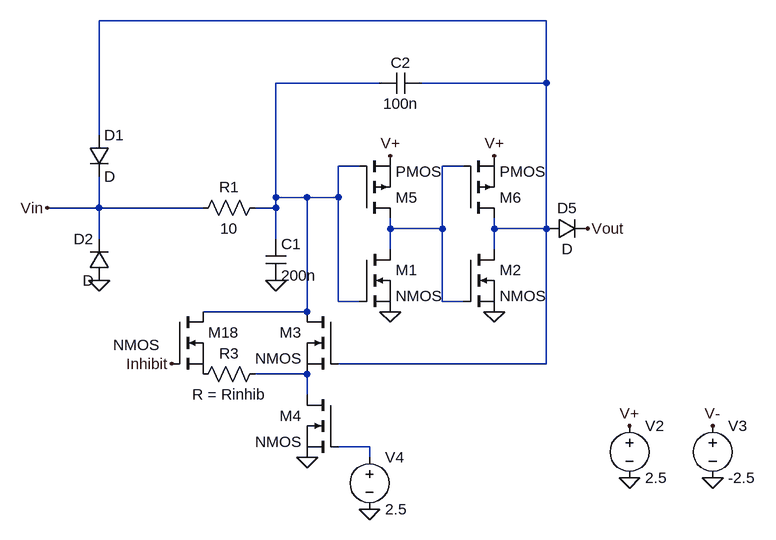
[diagram p0: schematic Axon-Hillock Post.asc]
Axon-Hillock Post.asc, the LTspice schematic file:
Version 4
SHEET 1 964 680
WIRE 640 -240 -48 -240
WIRE 384 -144 224 -144
WIRE 640 -144 640 -240
WIRE 640 -144 448 -144
WIRE -48 -64 -48 -240
WIRE 352 -16 320 -16
WIRE 512 -16 480 -16
WIRE 224 32 224 -144
WIRE 272 32 224 32
WIRE 320 32 320 -16
WIRE 320 32 272 32
WIRE -48 48 -48 0
WIRE -48 48 -128 48
WIRE 112 48 -48 48
WIRE 224 48 224 32
WIRE 224 48 192 48
WIRE 400 80 400 64
WIRE 480 80 480 -16
WIRE 480 80 400 80
WIRE 560 80 560 64
WIRE 640 80 640 -144
WIRE 640 80 560 80
WIRE -48 96 -48 48
WIRE 224 96 224 48
WIRE 400 112 400 80
WIRE 560 112 560 80
WIRE 320 192 320 32
WIRE 352 192 320 192
WIRE 480 192 480 80
WIRE 512 192 480 192
WIRE 272 208 272 32
WIRE 272 208 112 208
WIRE 640 288 640 80
WIRE 640 288 320 288
WIRE 272 304 192 304
WIRE 272 336 272 304
WIRE 368 416 320 416
WIRE 368 432 368 416
FLAG 368 512 0
FLAG 768 464 0
FLAG 896 464 0
FLAG 768 384 V+
FLAG 896 384 V-
FLAG 224 160 0
FLAG 400 -32 V+
FLAG 560 -32 V+
FLAG 560 208 0
FLAG 400 208 0
FLAG 272 432 0
FLAG 64 288 Inhibit
FLAG -128 48 Vin
FLAG 704 80 Vout
FLAG -48 160 0
SYMBOL res 208 32 R90
WINDOW 0 0 56 VBottom 2
WINDOW 3 32 56 VTop 2
SYMATTR InstName R1
SYMATTR Value 10
SYMBOL cap 208 96 R0
SYMATTR InstName C1
SYMATTR Value 200n
SYMBOL cap 448 -160 R90
WINDOW 0 0 32 VBottom 2
WINDOW 3 32 32 VTop 2
SYMATTR InstName C2
SYMATTR Value 100n
SYMBOL voltage 768 368 R0
WINDOW 123 0 0 Left 2
WINDOW 39 0 0 Left 2
SYMATTR InstName V2
SYMATTR Value 2.5
SYMBOL voltage 896 368 R0
WINDOW 123 0 0 Left 2
WINDOW 39 0 0 Left 2
SYMATTR InstName V3
SYMATTR Value -2.5
SYMBOL voltage 368 416 R0
WINDOW 123 0 0 Left 2
WINDOW 39 0 0 Left 2
SYMATTR InstName V4
SYMATTR Value 2.5
SYMBOL nmos 320 208 M0
SYMATTR InstName M3
SYMBOL nmos 320 336 M0
SYMATTR InstName M4
SYMBOL nmos 352 112 R0
SYMATTR InstName M1
SYMBOL nmos 512 112 R0
SYMATTR InstName M2
SYMBOL pmos 352 64 M180
SYMATTR InstName M5
SYMBOL pmos 512 64 M180
SYMATTR InstName M6
SYMBOL diode 640 96 R270
WINDOW 0 32 32 VTop 2
WINDOW 3 0 32 VBottom 2
SYMATTR InstName D5
SYMBOL nmos 64 208 R0
WINDOW 3 -90 51 Left 2
SYMATTR InstName M18
SYMBOL res 208 288 R90
WINDOW 0 0 56 VBottom 2
WINDOW 3 32 56 VTop 2
SYMATTR InstName R3
SYMATTR Value R = Rinhib
SYMBOL diode -64 -64 R0
SYMATTR InstName D1
SYMBOL diode -32 160 R180
WINDOW 0 24 64 Left 2
WINDOW 3 24 0 Left 2
SYMATTR InstName D2

The netlist it stands for:
* Axon-Hillock Post.asc
R1 N002 Vin 10
C1 N002 0 200n
C2 N001 N002 100n
V2 V+ 0 2.5
V3 V- 0 -2.5
V4 N005 0 2.5
M3 N002 N001 N004 N004 NMOS
M4 N004 N005 0 0 NMOS
M1 N003 N002 0 0 NMOS
M2 N001 N003 0 0 NMOS
M5 N003 N002 V+ V+ PMOS
M6 N001 N003 V+ V+ PMOS
D5 N001 Vout D
M18 N002 Inhibit P001 P001 NMOS
R3 N004 P001 R = Rinhib
D1 N001 Vin D
D2 0 Vin D
.model D D
.lib standard.dio
.model NMOS NMOS
.model PMOS PMOS
.lib standard.mos
.backanno
.end